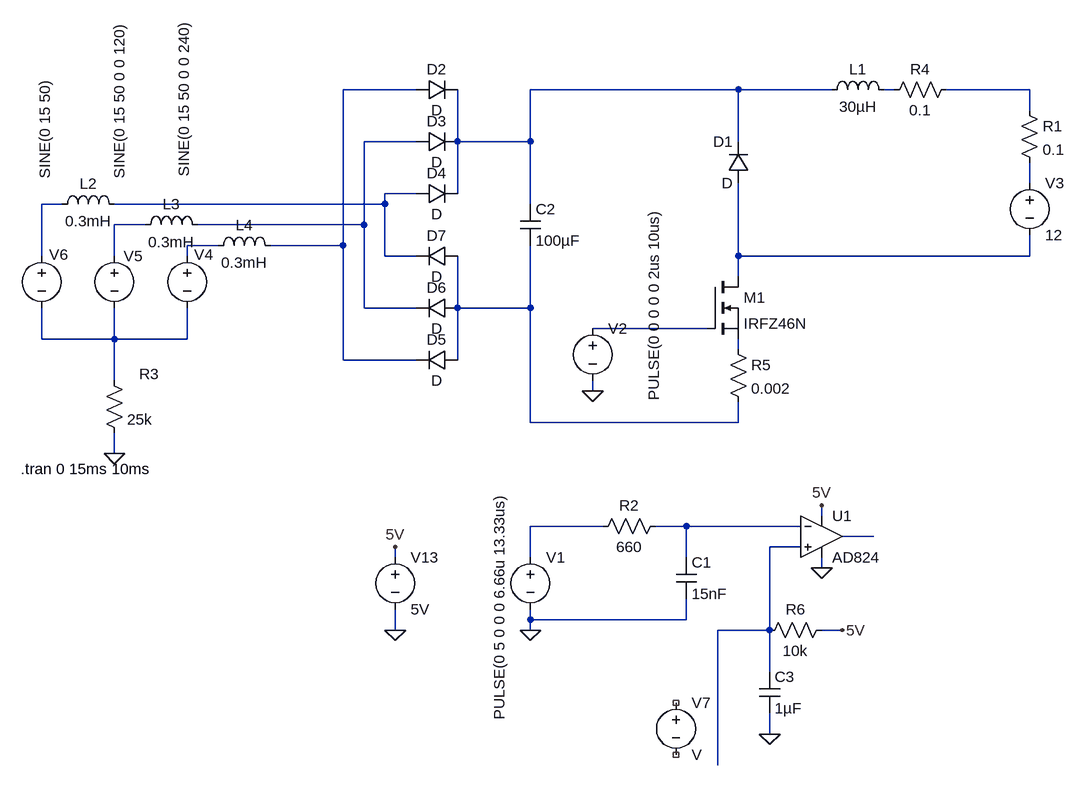
[diagram p0: schematic buck converter trial_regulated.asc]
buck converter trial_regulated.asc, the LTspice schematic file:
Version 4
SHEET 1 1692 1156
WIRE -128 -80 -240 -80
WIRE 368 -80 48 -80
WIRE 512 -80 368 -80
WIRE 608 -80 592 -80
WIRE 816 -80 688 -80
WIRE 816 -48 816 -80
WIRE -128 0 -208 0
WIRE -64 0 -64 -80
WIRE 48 0 48 -80
WIRE 48 0 -64 0
WIRE 368 0 368 -80
WIRE 816 64 816 32
WIRE -128 80 -176 80
WIRE -64 80 -64 0
WIRE -672 96 -704 96
WIRE -176 96 -176 80
WIRE -176 96 -592 96
WIRE 48 96 48 0
WIRE -544 128 -592 128
WIRE -208 128 -208 0
WIRE -208 128 -464 128
WIRE -432 160 -480 160
WIRE -240 160 -240 -80
WIRE -240 160 -352 160
WIRE -704 176 -704 96
WIRE -592 176 -592 128
WIRE -480 176 -480 160
WIRE -176 176 -176 96
WIRE -128 176 -176 176
WIRE 368 176 368 64
WIRE 816 176 816 144
WIRE 816 176 368 176
WIRE 368 208 368 176
WIRE -208 256 -208 128
WIRE -128 256 -208 256
WIRE -64 256 -64 176
WIRE 48 256 48 160
WIRE 48 256 -64 256
WIRE 320 288 144 288
WIRE -704 304 -704 256
WIRE -592 304 -592 256
WIRE -592 304 -704 304
WIRE -480 304 -480 256
WIRE -480 304 -592 304
WIRE 368 320 368 304
WIRE -240 336 -240 160
WIRE -128 336 -240 336
WIRE -64 336 -64 256
WIRE -592 368 -592 304
WIRE 144 384 144 368
WIRE 48 432 48 256
WIRE 368 432 368 400
WIRE 368 432 48 432
WIRE -592 480 -592 448
WIRE 496 576 496 560
WIRE 160 592 48 592
WIRE 288 592 240 592
WIRE 464 592 288 592
WIRE 576 608 528 608
WIRE 464 624 416 624
WIRE -160 640 -160 624
WIRE 48 640 48 592
WIRE 288 640 288 592
WIRE 496 656 496 640
WIRE 48 736 48 720
WIRE 288 736 288 704
WIRE 288 736 48 736
WIRE -160 752 -160 720
WIRE 48 752 48 736
WIRE 416 752 416 624
WIRE 416 752 336 752
WIRE 528 752 496 752
WIRE 416 816 416 752
WIRE 416 912 416 880
WIRE 336 960 336 752
FLAG -592 480 0
FLAG -160 752 0
FLAG -160 624 5V
FLAG 48 752 0
FLAG 496 656 0
FLAG 496 560 5V
FLAG 416 912 0
FLAG 528 752 5V
FLAG 144 384 0
SYMBOL nmos 320 208 R0
SYMATTR InstName M1
SYMATTR Value IRFZ46N
SYMBOL diode 384 64 R180
WINDOW 0 24 64 Left 2
WINDOW 3 24 0 Left 2
SYMATTR InstName D1
SYMBOL ind 496 -64 R270
WINDOW 0 32 56 VTop 2
WINDOW 3 5 56 VBottom 2
SYMATTR InstName L1
SYMATTR Value 30µH
SYMBOL voltage 816 48 R0
WINDOW 123 0 0 Left 0
WINDOW 39 0 0 Left 0
SYMATTR InstName V3
SYMATTR Value 12
SYMBOL res 800 -64 R0
SYMATTR InstName R1
SYMATTR Value 0.1
SYMBOL voltage -480 160 R0
WINDOW 123 0 0 Left 0
WINDOW 39 0 0 Left 0
WINDOW 0 11 14 Left 2
WINDOW 3 -5 -346 VRight 2
SYMATTR InstName V4
SYMATTR Value SINE(0 15 50 0 0 240)
SYMBOL voltage -592 160 R0
WINDOW 123 0 0 Left 0
WINDOW 39 0 0 Left 0
WINDOW 0 14 16 Left 2
WINDOW 3 8 -343 VRight 2
SYMATTR InstName V5
SYMATTR Value SINE(0 15 50 0 0 120)
SYMBOL voltage -704 160 R0
WINDOW 123 0 0 Left 0
WINDOW 39 0 0 Left 0
WINDOW 0 12 14 Left 2
WINDOW 3 5 -255 VRight 2
SYMATTR InstName V6
SYMATTR Value SINE(0 15 50)
SYMBOL diode -128 -64 R270
WINDOW 0 32 32 VTop 2
WINDOW 3 0 32 VBottom 2
SYMATTR InstName D2
SYMBOL diode -128 16 R270
WINDOW 0 32 32 VTop 2
WINDOW 3 0 32 VBottom 2
SYMATTR InstName D3
SYMBOL diode -128 96 R270
WINDOW 0 32 32 VTop 2
WINDOW 3 0 32 VBottom 2
SYMATTR InstName D4
SYMBOL diode -64 320 R90
WINDOW 0 0 32 VBottom 2
WINDOW 3 32 32 VTop 2
SYMATTR InstName D5
SYMBOL diode -64 240 R90
WINDOW 0 0 32 VBottom 2
WINDOW 3 32 32 VTop 2
SYMATTR InstName D6
SYMBOL diode -64 160 R90
WINDOW 0 0 32 VBottom 2
WINDOW 3 32 32 VTop 2
SYMATTR InstName D7
SYMBOL cap 32 96 R0
SYMATTR InstName C2
SYMATTR Value 100µF
SYMBOL res -608 352 R0
WINDOW 0 54 6 Left 2
SYMATTR InstName R3
SYMATTR Value 25k
SYMBOL res 704 -96 R90
WINDOW 0 0 56 VBottom 2
WINDOW 3 32 56 VTop 2
SYMATTR InstName R4
SYMATTR Value 0.1
SYMBOL res 352 304 R0
SYMATTR InstName R5
SYMATTR Value 0.002
SYMBOL ind -688 112 R270
WINDOW 0 32 56 VTop 2
WINDOW 3 5 56 VBottom 2
SYMATTR InstName L2
SYMATTR Value 0.3mH
SYMBOL ind -560 144 R270
WINDOW 0 32 56 VTop 2
WINDOW 3 5 56 VBottom 2
SYMATTR InstName L3
SYMATTR Value 0.3mH
SYMBOL ind -448 176 R270
WINDOW 0 32 56 VTop 2
WINDOW 3 5 56 VBottom 2
SYMATTR InstName L4
SYMATTR Value 0.3mH
SYMBOL voltage -160 624 R0
WINDOW 123 0 0 Left 0
WINDOW 39 0 0 Left 0
SYMATTR InstName V13
SYMATTR Value 5V
SYMBOL voltage 48 624 R0
WINDOW 3 -48 -83 VRight 2
WINDOW 123 0 0 Left 0
WINDOW 39 0 0 Left 0
SYMATTR InstName V1
SYMATTR Value PULSE(0 5 0 0 0 6.66u 13.33us)
SYMBOL res 256 576 R90
WINDOW 0 0 56 VBottom 2
WINDOW 3 32 56 VTop 2
SYMATTR InstName R2
SYMATTR Value 660
SYMBOL cap 272 640 R0
SYMATTR InstName C1
SYMATTR Value 15nF
SYMBOL OpAmps\\AD824 496 544 R0
SYMATTR InstName U1
SYMBOL cap 400 816 R0
SYMATTR InstName C3
SYMATTR Value 1µF
SYMBOL res 512 736 R90
WINDOW 0 0 56 VBottom 2
WINDOW 3 32 56 VTop 2
SYMATTR InstName R6
SYMATTR Value 10k
SYMBOL voltage 144 272 R0
WINDOW 3 94 -167 VRight 2
WINDOW 123 0 0 Left 0
WINDOW 39 0 0 Left 0
SYMATTR InstName V2
SYMATTR Value PULSE(0 0 0 0 0 2us 10us)
SYMBOL voltage 272 848 R0
SYMATTR InstName V7
TEXT -736 504 Left 2 !.tran 0 15ms 10ms

The netlist it stands for:
* buck converter trial_regulated.asc
M1 N011 N013 N015 N015 IRFZ46N
D1 N011 N002 D
L1 N002 N003 30µH
V3 N006 N011 12
R1 N004 N006 0.1
V4 N010 N014 SINE(0 15 50 0 0 240)
V5 N009 N014 SINE(0 15 50 0 0 120)
V6 N008 N014 SINE(0 15 50)
D2 N001 N002 D
D3 N005 N002 D
D4 N007 N002 D
D5 N012 N001 D
D6 N012 N005 D
D7 N012 N007 D
C2 N002 N012 100µF
R3 N014 0 25k
R4 N004 N003 0.1
R5 N015 N012 0.002
L2 N008 N007 0.3mH
L3 N009 N005 0.3mH
L4 N010 N001 0.3mH
V13 5V 0 5V
V1 N016 0 PULSE(0 5 0 0 0 6.66u 13.33us)
R2 N017 N016 660
C1 N017 0 15nF
XU1 N019 N017 5V 0 N018 AD824  ; pins In+ In- V+ V- OUT
C3 N019 0 1µF
R6 5V N019 10k
V2 N013 0 PULSE(0 0 0 0 0 2us 10us)
V7 NC_01 NC_02 V
.model D D
.lib standard.dio
.model NMOS NMOS
.model PMOS PMOS
.lib standard.mos
.tran 0 15ms 10ms
.backanno
.end